# EAGLE design untitled (EAGLE 7.5.0)
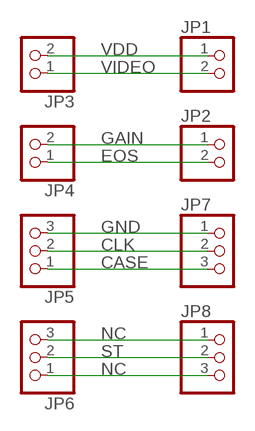
[diagram p0: schematic, sheet 1]

## Parts
JP1  PINHD-1X2  [1X02]
JP2  PINHD-1X2  [1X02]
JP3  PINHD-1X2  [1X02]
JP4  PINHD-1X2  [1X02]
JP5  PINHD-1X3  [1X03]
JP6  PINHD-1X3  [1X03]
JP7  PINHD-1X3  [1X03]
JP8  PINHD-1X3  [1X03]

## Nets
CASE: JP5.1 JP7.3
CLK: JP5.2 JP7.2
EOS: JP2.2 JP4.1
GAIN: JP2.1 JP4.2
GND: JP5.3 JP7.1
NC: JP6.1 JP6.3 JP8.1 JP8.3
ST: JP6.2 JP8.2
VDD: JP1.1 JP3.2
VIDEO: JP1.2 JP3.1

## Library data of the parts
JP1-JP4 = pinhead:PINHD-1X2: PIN HEADER
JP5-JP8 = pinhead:PINHD-1X3: PIN HEADER

## Board
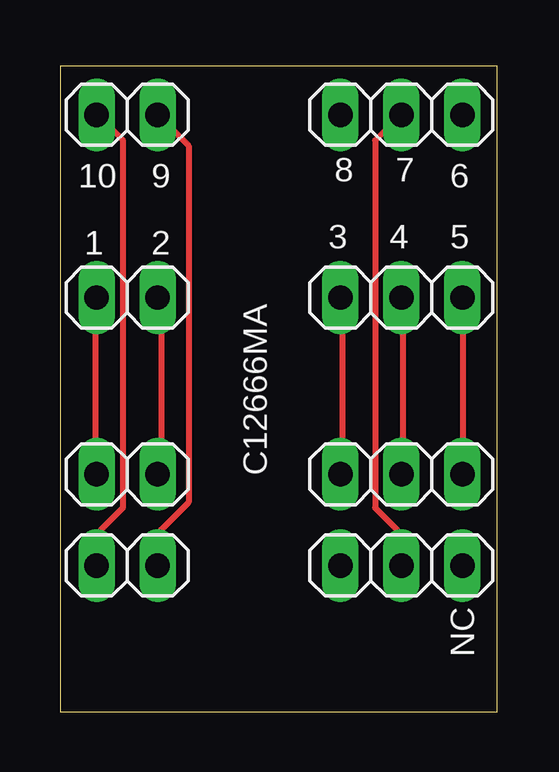
[diagram p1: board, top side]
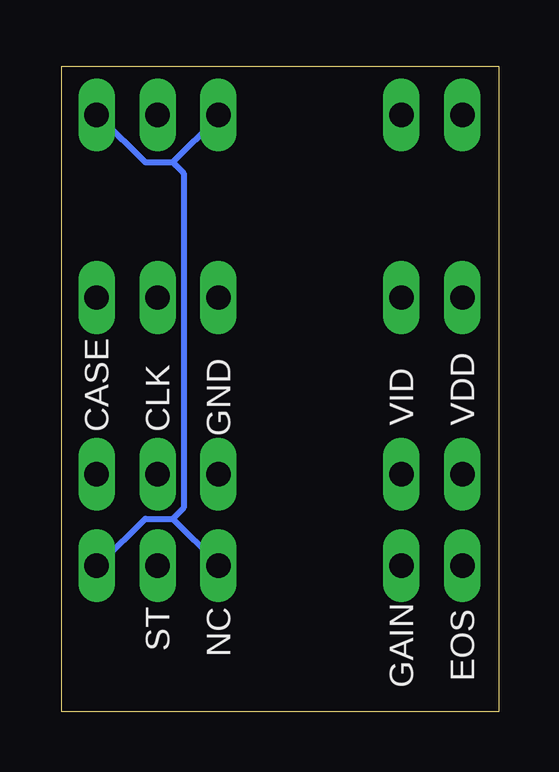
[diagram p2: board, bottom side, seen from below]

Size 18.21 x 26.91 mm. Coordinates in mm from the lower left corner, seen from the top.
Outline: 0,0 18.21,0 18.21,26.91 0,26.91 0,0
Copper layers (1*16): Top 0.035mm / dielectric 1.5mm / Bottom 0.035mm
Design rules "default": minimum track width 10mil, minimum drill 24mil, track to track 8mil, track to pad 8mil, pad to pad 8mil, via to via 8mil, smd to smd 8mil, copper to edge 40mil, drill to drill 8mil, minimum pad ring 10mil, minimum via ring 8mil, stop-mask expansion 4mil, vias tented up to drill 0mil, thermal gap 10mil

### Footprints (pad centres in the part's own frame; a part is rotated, then mirrored left to right if it is on the bottom)
1X02 = drill 1.016 long: 1 -1.27,0; 2 1.27,0
1X03 = drill 1.016 long: 1 -2.54,0; 2 0,0; 3 2.54,0

### Placement (x,y rotation side)
JP1  2.79,9.91 0 top
JP2  2.79,6.1 180 top
JP3  2.79,17.27 180 top
JP4  2.79,24.89 0 top
JP5  14.22,17.27 180 top
JP6  14.22,24.89 0 top
JP7  14.22,9.91 0 top
JP8  14.22,6.1 180 top

### Tracks (layer width: path | path; a pad name or v marks a point on that pad's centre or on a via)
CASE
  Top 0.254: JP7.3 16.79,10.11 16.79,17.2 JP5.1
CLK
  Top 0.254: JP7.2 14.27,10.11 14.27,17.2 JP5.2
EOS
  Top 0.254: JP2.2 1.7,6.22 1.7,7.59 2.62,8.51 2.62,23.83 1.7,24.74 JP4.1
GAIN
  Top 0.254: JP4.2 5.36,23.6 5.36,8.74 4.22,7.59 4.22,6.22 JP2.1
GND
  Top 0.254: JP7.1 11.76,10.11 11.76,17.2 JP5.3
NC
  Bottom 0.254: 13.59,8.05 11.76,6.22 JP8.3 | 13.59,8.05 14.73,8.05 16.56,6.22 JP8.1 | 13.59,22.91 11.76,24.74 JP6.1 | 13.59,22.91 14.73,22.91 16.56,24.74 JP6.3 | 13.59,8.05 13.13,8.51 13.13,22.45 13.59,22.91
ST
  Top 0.254: JP8.2 14.05,6.22 14.05,7.59 13.13,8.51 13.13,23.83 14.05,24.74 JP6.2
VDD
  Top 0.254: JP1.1 1.47,10.11 1.47,17.2 JP3.2
VIDEO
  Top 0.254: JP1.2 4.22,10.11 4.22,17.2 JP3.1

### Text on the board
tPlace: 10 | 9 | 8 | 7 | 6 | 1 | 2 | 3 | 4 | 5 | C12666MA | NC
bPlace: GND | VDD | VID | CLK | CASE | ST | NC | EOS | GAIN